# Altium schematic sheet RadioSignalBlocker.SchDoc: Antenna
size A; CompanyName: CUInSpace; DrawnBy: Matteo Golin; Engineer: Matteo Golin; Organization: CUInSpace; Revision: B; SheetNumber: 4; SheetTotal: 4
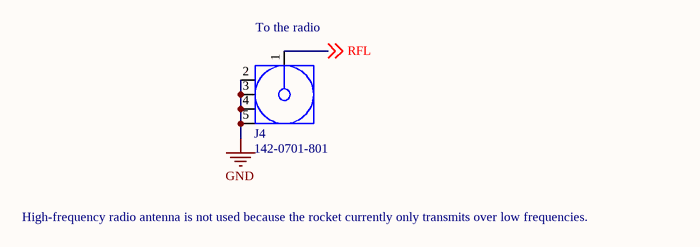
[diagram p0: RadioSignalBlocker.SchDoc]

## Parts
J4  142-0701-801  [CINC-142-0701-801_V]

## Nets
GND: J4.2 J4.3 J4.4 J4.5
RFL: J4.1 ; off-sheet RFL

## Notes on the sheet
- (near J4) To the radio
- High-frequency radio antenna is not used because the rocket currently only transmits over low frequencies.

## Library data of the parts
J4 = CMP-2000-05490-1: SMA End Launch Jack Receptacle, 50 Ohm, 0 to 18 GHz, -65 to 165 degC, 5-Pin SMD, RoHS, Bulk; Manufacturer: EmersonConnectivitySolutions; Connector Type: JackPCB; Gender: Jack(Female); Impedance: 50Ohms; Brand: Johnson/EmersonConnectivitySolutions; Body Material: Brass; Body Style: Straight; Maximum Frequency: 18GHz; Factory Pack Quantity: 5; Datasheet URL: https://belfuse.com/resources/Johnson/productinformation/pi-142-0701-801.pdf; Datasheet Version: 12/2014; Operating Temperature Range: -65Cto+165C; Mounting Technology: SurfaceMount; RF Series: SMA; Package Reference: 142-0701-801; Product Category: RFConnectors/CoaxialConnectors; Termination Style: Solder; RoHS: Details; Package URL: https://belfuse.com/resources/Johnson/drawings/dr-1420701801.pdf; Series: SMA; Package Description: 5-Pin Surface Mount Device, Body 14.275 x 9.525 mm; Manufacturer URL: http://www.cinch.com/; Contact Plating: Gold; Product: Connectors; Orientation: Straight